# EAGLE schematic M885E (EAGLE 6.6.0)
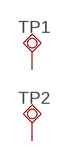
[diagram p0: schematic, sheet 1, part 1 of 2]
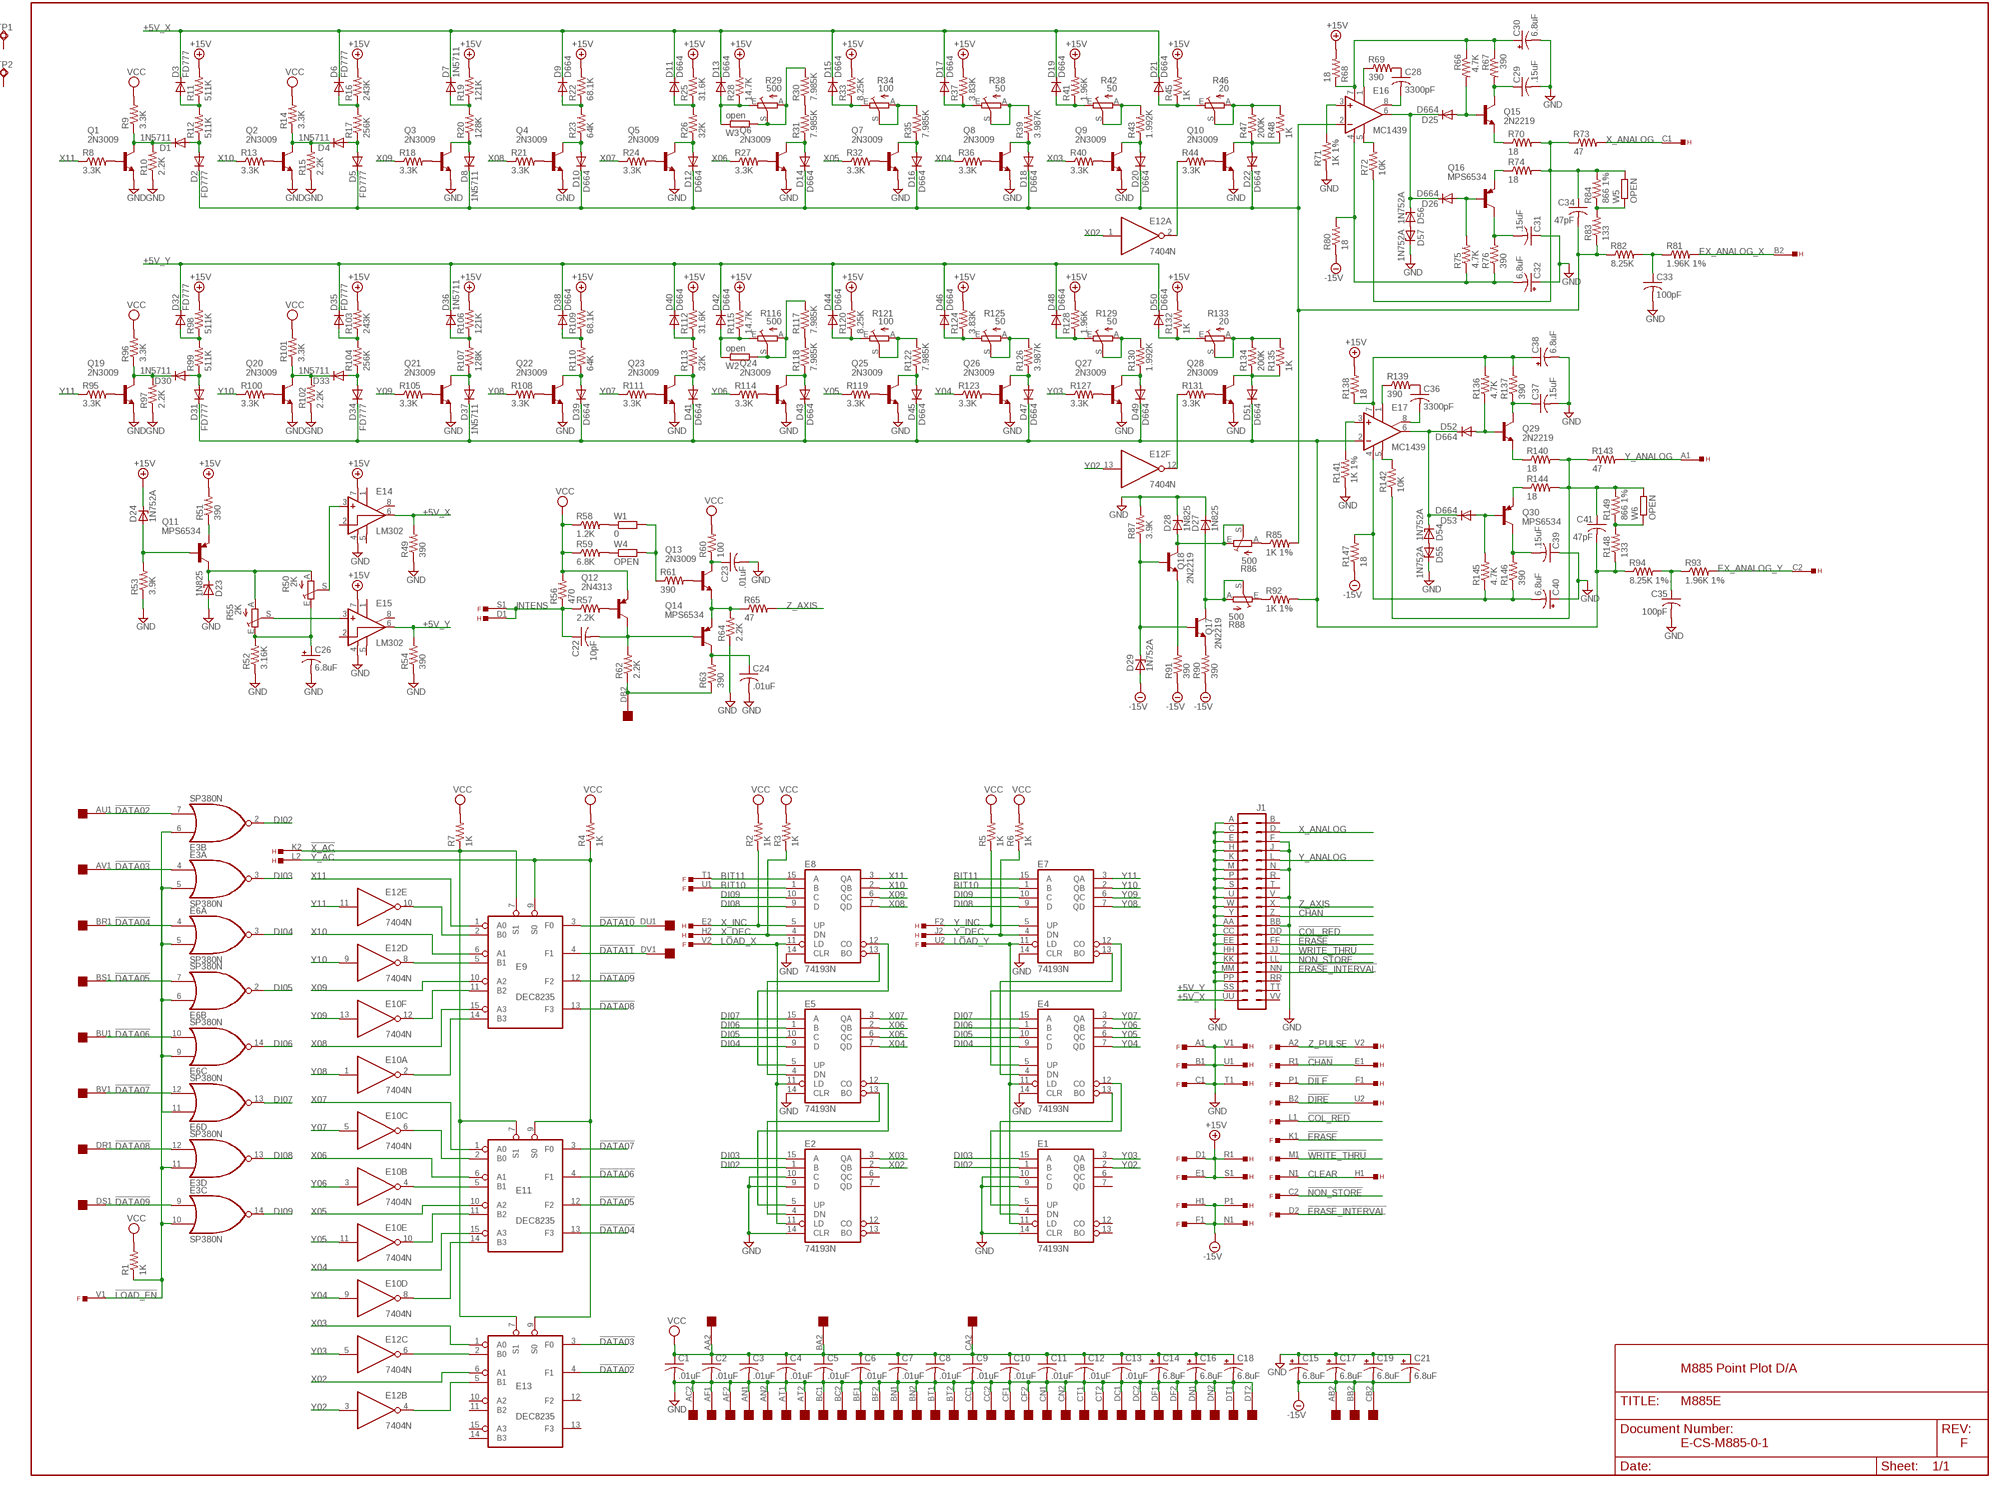
[diagram p1: schematic, sheet 1, part 2 of 2]

## Parts
C1  .01uF  C-US  [C063-025X075]
C2  .01uF  C-US  [C063-025X075]
C3  .01uF  C-US  [C063-025X075]
C4  .01uF  C-US  [C063-025X075]
C5  .01uF  C-US  [C063-025X075]
C6  .01uF  C-US  [C063-025X075]
C7  .01uF  C-US  [C063-025X075]
C8  .01uF  C-US  [C063-025X075]
C9  .01uF  C-US  [C063-025X075]
C10  .01uF  C-US  [C063-025X075]
C11  .01uF  C-US  [C063-025X075]
C12  .01uF  C-US  [C063-025X075]
C13  .01uF  C-US  [C063-025X075]
C14  6.8uF  CPOL-USE20-8AXIAL  [E12-8]
C15  6.8uF  CPOL-USE20-8AXIAL  [E12-8]
C16  6.8uF  CPOL-USE20-8AXIAL  [E12-8]
C17  6.8uF  CPOL-USE20-8AXIAL  [E12-8]
C18  6.8uF  CPOL-USE20-8AXIAL  [E12-8]
C19  6.8uF  CPOL-USE20-8AXIAL  [E12-8]
C21  6.8uF  CPOL-USE20-8AXIAL  [E12-8]
C22  10pF  C-US  [C063-025X075]
C23  .01uF  C-US  [C063-025X075]
C24  .01uF  C-US  [C063-025X075]
C26  6.8uF  CPOL-USE20-8AXIAL  [E12-8]
C28  3300pF  C-US150-054X183  [C150-054X183]
C29  .15uF  C-US150-054X183  [C150-054X183]
C30  6.8uF  CPOL-USE20-8AXIAL  [E12-8]
C31  .15uF  C-US150-054X183  [C150-054X183]
C32  6.8uF  CPOL-USE20-8AXIAL  [E12-8]
C33  100pF  C-US  [C063-025X075]
C34  47pF  C-US  [C063-025X075]
C35  100pF  C-US  [C063-025X075]
C36  3300pF  C-US150-054X183  [C150-054X183]
C37  .15uF  C-US150-054X183  [C150-054X183]
C38  6.8uF  CPOL-USE20-8AXIAL  [E12-8]
C39  .15uF  C-US150-054X183  [C150-054X183]
C40  6.8uF  CPOL-USE20-8AXIAL  [E12-8]
C41  47pF  C-US  [C063-025X075]
D1  1N5711  DIODE-DO35-10  [DO35-10]
D2  FD777  DIODE-DO35-10  [DO35-10]
D3  FD777  DIODE-DO35-10  [DO35-10]
D4  1N5711  DIODE-DO35-10  [DO35-10]
D5  FD777  DIODE-DO35-10  [DO35-10]
D6  FD777  DIODE-DO35-10  [DO35-10]
D7  1N5711  DIODE-DO35-10  [DO35-10]
D8  1N5711  DIODE-DO35-10  [DO35-10]
D9  D664  DIODE-DO35-10  [DO35-10]
D10  D664  DIODE-DO35-10  [DO35-10]
D11  D664  DIODE-DO35-10  [DO35-10]
D12  D664  DIODE-DO35-10  [DO35-10]
D13  D664  DIODE-DO35-10  [DO35-10]
D14  D664  DIODE-DO35-10  [DO35-10]
D15  D664  DIODE-DO35-10  [DO35-10]
D16  D664  DIODE-DO35-10  [DO35-10]
D17  D664  DIODE-DO35-10  [DO35-10]
D18  D664  DIODE-DO35-10  [DO35-10]
D19  D664  DIODE-DO35-10  [DO35-10]
D20  D664  DIODE-DO35-10  [DO35-10]
D21  D664  DIODE-DO35-10  [DO35-10]
D22  D664  DIODE-DO35-10  [DO35-10]
D23  1N825  ZENER-DIODEDO35Z10  [DO35Z10]
D24  1N752A  ZENER-DIODEDO35Z10  [DO35Z10]
D25  D664  DIODE-DO35-10  [DO35-10]
D26  D664  DIODE-DO35-10  [DO35-10]
D27  1N825  ZENER-DIODEDO35Z10  [DO35Z10]
D28  1N825  ZENER-DIODEDO35Z10  [DO35Z10]
D29  1N752A  ZENER-DIODEDO35Z10  [DO35Z10]
D30  1N5711  DIODE-DO35-10  [DO35-10]
D31  FD777  DIODE-DO35-10  [DO35-10]
D32  FD777  DIODE-DO35-10  [DO35-10]
D33  1N5711  DIODE-DO35-10  [DO35-10]
D34  FD777  DIODE-DO35-10  [DO35-10]
D35  FD777  DIODE-DO35-10  [DO35-10]
D36  1N5711  DIODE-DO35-10  [DO35-10]
D37  1N5711  DIODE-DO35-10  [DO35-10]
D38  D664  DIODE-DO35-10  [DO35-10]
D39  D664  DIODE-DO35-10  [DO35-10]
D40  D664  DIODE-DO35-10  [DO35-10]
D41  D664  DIODE-DO35-10  [DO35-10]
D42  D664  DIODE-DO35-10  [DO35-10]
D43  D664  DIODE-DO35-10  [DO35-10]
D44  D664  DIODE-DO35-10  [DO35-10]
D45  D664  DIODE-DO35-10  [DO35-10]
D46  D664  DIODE-DO35-10  [DO35-10]
D47  D664  DIODE-DO35-10  [DO35-10]
D48  D664  DIODE-DO35-10  [DO35-10]
D49  D664  DIODE-DO35-10  [DO35-10]
D50  D664  DIODE-DO35-10  [DO35-10]
D51  D664  DIODE-DO35-10  [DO35-10]
D52  D664  DIODE-DO35-10  [DO35-10]
D53  D664  DIODE-DO35-10  [DO35-10]
D54  1N752A  ZENER-DIODEDO35Z10  [DO35Z10]
D55  1N752A  ZENER-DIODEDO35Z10  [DO35Z10]
D56  1N752A  ZENER-DIODEDO35Z10  [DO35Z10]
D57  1N752A  ZENER-DIODEDO35Z10  [DO35Z10]
E1  74193N  [DIL16]
E2  74193N  [DIL16]
E3  SP380N  [DIL14]
E4  74193N  [DIL16]
E5  74193N  [DIL16]
E6  SP380N  [DIL14]
E7  74193N  [DIL16]
E8  74193N  [DIL16]
E9  DEC8235  [DIL16]
E10  7404N  [DIL14]
E11  DEC8235  [DIL16]
E12  7404N  [DIL14]
E13  DEC8235  [DIL16]
E14  LM302  AD504H  [TO99]
E15  LM302  AD504H  [TO99]
E16  MC1439  AD504H  [TO99]
E17  MC1439  AD504H  [TO99]
F  EDGE-TOP  [EDGE-CON2]
H  EDGE-TOP  [EDGE-CON2]
J1  DEC40PINH  [DEC40PINH]
OMNIBUS  QUAD  [EDGE-CON8]
Q1  2N3009  -NPN-TO5  [TO5]
Q2  2N3009  -NPN-TO5  [TO5]
Q3  2N3009  -NPN-TO5  [TO5]
Q4  2N3009  -NPN-TO5  [TO5]
Q5  2N3009  -NPN-TO5  [TO5]
Q6  2N3009  -NPN-TO5  [TO5]
Q7  2N3009  -NPN-TO5  [TO5]
Q8  2N3009  -NPN-TO5  [TO5]
Q9  2N3009  -NPN-TO5  [TO5]
Q10  2N3009  -NPN-TO5  [TO5]
Q11  MPS6534  -PNP-TO5  [TO5]
Q12  2N4313  -PNP-TO5  [TO5]
Q13  2N3009  -NPN-TO5  [TO5]
Q14  MPS6534  -PNP-TO5  [TO5]
Q15  2N2219  -NPN-TO5  [TO5]
Q16  MPS6534  -PNP-TO5  [TO5]
Q17  2N2219  -NPN-TO5  [TO5]
Q18  2N2219  -NPN-TO5  [TO5]
Q19  2N3009  -NPN-TO5  [TO5]
Q20  2N3009  -NPN-TO5  [TO5]
Q21  2N3009  -NPN-TO5  [TO5]
Q22  2N3009  -NPN-TO5  [TO5]
Q23  2N3009  -NPN-TO5  [TO5]
Q24  2N3009  -NPN-TO5  [TO5]
Q25  2N3009  -NPN-TO5  [TO5]
Q26  2N3009  -NPN-TO5  [TO5]
Q27  2N3009  -NPN-TO5  [TO5]
Q28  2N3009  -NPN-TO5  [TO5]
Q29  2N2219  -NPN-TO5  [TO5]
Q30  MPS6534  -PNP-TO5  [TO5]
R1  1K  R-US_0207/10  [0207/10]
R2  1K  R-US_0207/10  [0207/10]
R3  1K  R-US_0207/10  [0207/10]
R4  1K  R-US_0207/10  [0207/10]
R5  1K  R-US_0207/10  [0207/10]
R6  1K  R-US_0207/10  [0207/10]
R7  1K  R-US_0207/10  [0207/10]
R8  3.3K  R-US_0207/10  [0207/10]
R9  3.3K  R-US_0207/10  [0207/10]
R10  2.2K  R-US_0207/10  [0207/10]
R11  511K  R-US_0207/15  [0207/15]
R12  511K  R-US_0207/15  [0207/15]
R13  3.3K  R-US_0207/10  [0207/10]
R14  3.3K  R-US_0207/10  [0207/10]
R15  2.2K  R-US_0207/10  [0207/10]
R16  243K  R-US_0207/15  [0207/15]
R17  256K  R-US_0207/15  [0207/15]
R18  3.3K  R-US_0207/10  [0207/10]
R19  121K  R-US_0207/15  [0207/15]
R20  128K  R-US_0207/15  [0207/15]
R21  3.3K  R-US_0207/10  [0207/10]
R22  68.1K  R-US_0207/15  [0207/15]
R23  64K  R-US_0207/15  [0207/15]
R24  3.3K  R-US_0207/10  [0207/10]
R25  31.6K  R-US_0207/15  [0207/15]
R26  32K  R-US_0207/15  [0207/15]
R27  3.3K  R-US_0207/10  [0207/10]
R28  14.7K  R-US_0207/15  [0207/15]
R29  500  TRIM_EU-S75P  [S75P]
R30  7.985K  R-US_0207/15  [0207/15]
R31  7.985K  R-US_0207/15  [0207/15]
R32  3.3K  R-US_0207/10  [0207/10]
R33  8.25K  R-US_0207/15  [0207/15]
R34  100  TRIM_EU-S75P  [S75P]
R35  7.985K  R-US_0207/15  [0207/15]
R36  3.3K  R-US_0207/10  [0207/10]
R37  3.83K  R-US_0207/15  [0207/15]
R38  50  TRIM_EU-S75P  [S75P]
R39  3.987K  R-US_0207/15  [0207/15]
R40  3.3K  R-US_0207/10  [0207/10]
R41  1.96K  R-US_0207/15  [0207/15]
R42  50  TRIM_EU-S75P  [S75P]
R43  1.992K  R-US_0207/15  [0207/15]
R44  3.3K  R-US_0207/10  [0207/10]
R45  1K  R-US_0207/15  [0207/15]
R46  20  TRIM_EU-S75P  [S75P]
R47  200K  R-US_0207/15  [0207/15]
R48  1K  R-US_0207/15  [0207/15]
R49  390  R-US_0207/10  [0207/10]
R50  2K  TRIM_EU-B90P  [SP19L]
R51  390  R-US_0207/10  [0207/10]
R52  3.16K  R-US_0207/15  [0207/15]
R53  3.9K  R-US_0207/10  [0207/10]
R54  390  R-US_0207/10  [0207/10]
R55  2K  TRIM_EU-B90P  [SP19L]
R56  470  R-US_0207/10  [0207/10]
R57  2.2K  R-US_0207/10  [0207/10]
R58  1.2K  R-US_0207/10  [0207/10]
R59  6.8K  R-US_0207/10  [0207/10]
R60  100  R-US_0207/10  [0207/10]
R61  390  R-US_0207/10  [0207/10]
R62  2.2K  R-US_0207/10  [0207/10]
R63  390  R-US_0207/10  [0207/10]
R64  2.2K  R-US_0207/10  [0207/10]
R65  47  R-US_0207/10  [0207/10]
R66  4.7K  R-US_0207/10  [0207/10]
R67  390  R-US_0207/10  [0207/10]
R68  18  R-US_0207/10  [0207/10]
R69  390  R-US_0207/10  [0207/10]
R70  18  R-US_0207/10  [0207/10]
R71  1K 1%  R-US_0207/15  [0207/15]
R72  10K  R-US_0207/10  [0207/10]
R73  47  R-US_0207/10  [0207/10]
R74  18  R-US_0207/10  [0207/10]
R75  4.7K  R-US_0207/10  [0207/10]
R76  390  R-US_0207/10  [0207/10]
R80  18  R-US_0207/10  [0207/10]
R81  1.96K 1%  R-US_0207/15  [0207/15]
R82  8.25K  R-US_0207/15  [0207/15]
R83  133  R-US_0207/15  [0207/15]
R84  866 1%  R-US_0207/15  [0207/15]
R85  1K 1%  R-US_0207/15  [0207/15]
R86  500  TRIM_EU-B90P  [SP19L]
R87  3.9K  R-US_0207/10  [0207/10]
R88  500  TRIM_EU-B90P  [SP19L]
R90  390  R-US_0207/10  [0207/10]
R91  390  R-US_0207/10  [0207/10]
R92  1K 1%  R-US_0207/15  [0207/15]
R93  1.96K 1%  R-US_0207/15  [0207/15]
R94  8.25K 1%  R-US_0207/10  [0207/10]
R95  3.3K  R-US_0207/10  [0207/10]
R96  3.3K  R-US_0207/10  [0207/10]
R97  2.2K  R-US_0207/10  [0207/10]
R98  511K  R-US_0207/15  [0207/15]
R99  511K  R-US_0207/15  [0207/15]
R100  3.3K  R-US_0207/10  [0207/10]
R101  3.3K  R-US_0207/10  [0207/10]
R102  2.2K  R-US_0207/10  [0207/10]
R103  243K  R-US_0207/15  [0207/15]
R104  256K  R-US_0207/15  [0207/15]
R105  3.3K  R-US_0207/10  [0207/10]
R106  121K  R-US_0207/15  [0207/15]
R107  128K  R-US_0207/15  [0207/15]
R108  3.3K  R-US_0207/10  [0207/10]
R109  68.1K  R-US_0207/15  [0207/15]
R110  64K  R-US_0207/15  [0207/15]
R111  3.3K  R-US_0207/10  [0207/10]
R112  31.6K  R-US_0207/15  [0207/15]
R113  32K  R-US_0207/15  [0207/15]
R114  3.3K  R-US_0207/10  [0207/10]
R115  14.7K  R-US_0207/15  [0207/15]
R116  500  TRIM_EU-S75P  [S75P]
R117  7.985K  R-US_0207/15  [0207/15]
R118  7.985K  R-US_0207/15  [0207/15]
R119  3.3K  R-US_0207/10  [0207/10]
R120  8.25K  R-US_0207/15  [0207/15]
R121  100  TRIM_EU-S75P  [S75P]
R122  7.985K  R-US_0207/15  [0207/15]
R123  3.3K  R-US_0207/10  [0207/10]
R124  3.83K  R-US_0207/15  [0207/15]
R125  50  TRIM_EU-S75P  [S75P]
R126  3.987K  R-US_0207/15  [0207/15]
R127  3.3K  R-US_0207/10  [0207/10]
R128  1.96K  R-US_0207/15  [0207/15]
R129  50  TRIM_EU-S75P  [S75P]
R130  1.992K  R-US_0207/15  [0207/15]
R131  3.3K  R-US_0207/10  [0207/10]
R132  1K  R-US_0207/15  [0207/15]
R133  20  TRIM_EU-S75P  [S75P]
R134  200K  R-US_0207/15  [0207/15]
R135  1K  R-US_0207/15  [0207/15]
R136  4.7K  R-US_0207/10  [0207/10]
R137  390  R-US_0207/10  [0207/10]
R138  18  R-US_0207/10  [0207/10]
R139  390  R-US_0207/10  [0207/10]
R140  18  R-US_0207/10  [0207/10]
R141  1K 1%  R-US_0207/15  [0207/15]
R142  10K  R-US_0207/10  [0207/10]
R143  47  R-US_0207/10  [0207/10]
R144  18  R-US_0207/10  [0207/10]
R145  4.7K  R-US_0207/10  [0207/10]
R146  390  R-US_0207/10  [0207/10]
R147  18  R-US_0207/10  [0207/10]
R148  133  R-US_0207/15  [0207/15]
R149  866 1%  R-US_0207/15  [0207/15]
TP1  TPSQPAD1-17  [P1-17]
TP2  TPSQPAD1-17  [P1-17]
W1  0  R-EU_0207/10  [0207/10]
W2  open  R-EU_0207/10  [0207/10]
W3  open  R-EU_0207/10  [0207/10]
W4  OPEN  R-EU_0207/10  [0207/10]
W5  OPEN  R-EU_0207/10  [0207/10]
W6  OPEN  R-EU_0207/10  [0207/10]

## Nets
!CHAN: F.R1 H.E1 J1.Z
!COL_RED: F.L1 J1.DD
!DATA02: E3.7(B:I1) E13.4(F1) OMNIBUS.AU1
!DATA03: E3.4(A:I0) E13.3(F0) OMNIBUS.AV1
!DATA04: E6.4(A:I0) E11.13(F3) OMNIBUS.BR1
!DATA05: E6.7(B:I1) E11.12(F2) OMNIBUS.BS1
!DATA06: E6.10(C:I1) E11.4(F1) OMNIBUS.BU1
!DATA07: E6.12(D:I1) E11.3(F0) OMNIBUS.BV1
!DATA08: E3.12(D:I1) E9.13(F3) OMNIBUS.DR1
!DATA09: E3.9(C:I0) E9.12(F2) OMNIBUS.DS1
!DATA10: E9.3(F0) OMNIBUS.DU1
!DATA11: E9.4(F1) OMNIBUS.DV1
!DILE: F.P1 H.F1
!DIRE: F.B2 H.U2
!ERASE: F.K1 J1.FF
!ERASE_INTERVAL: F.D2 J1.NN
!LOAD_EN: E3.5(A:I1) E3.6(B:I0) E3.10(C:I1) E3.11(D:I0) E6.5(A:I1) E6.6(B:I0) E6.9(C:I0) E6.11(D:I0) F.V1 R1.1
!NON_STORE: F.C2 J1.LL
!WRITE_THRU: F.M1 J1.JJ
!X_AC: E9.7(S1) E11.7(S1) E13.7(S1) H.K2 R7.1
!Y_AC: E9.9(S0) E11.9(S0) E13.9(S0) H.L2 R4.1
+5V_X [supply]: D3.C D6.C D7.C D9.C D11.C D13.C D15.C D17.C D19.C D21.C E14.6(OUT) J1.UU R49.2
+5V_Y [supply]: D32.C D35.C D36.C D38.C D40.C D42.C D44.C D46.C D48.C D50.C E15.6(OUT) J1.SS R54.2
+15V [supply]: D24.C E14.7(V+) E15.7(V+) F.D1 F.E1 H.R1 H.S1 R11.2 R16.2 R19.2 R22.2 R25.2 R28.2 R33.2 R37.2 R41.2 R45.2 R51.2 R68.2 R98.2 R103.2 R106.2 R109.2 R112.2 R115.2 R120.2 R124.2 R128.2 R132.2 R138.2
-15V [supply]: C15.- C17.- C19.- C21.- D29.A F.F1 F.H1 H.N1 H.P1 OMNIBUS.AB2 OMNIBUS.BB2 OMNIBUS.CB2 R80.1 R90.1 R91.1 R147.1
BIT10: E7.1(B) E8.1(B) F.U1
BIT11: E7.15(A) E8.15(A) F.T1
CLEAR: F.N1 H.H1
DI02: E1.1(B) E2.1(B) E3.2(B:O)
DI03: E1.15(A) E2.15(A) E3.3(A:O)
DI04: E4.9(D) E5.9(D) E6.3(A:O)
DI05: E4.10(C) E5.10(C) E6.2(B:O)
DI06: E4.1(B) E5.1(B) E6.14(C:O)
DI07: E4.15(A) E5.15(A) E6.13(D:O)
DI08: E3.13(D:O) E7.9(D) E8.9(D)
DI09: E3.14(C:O) E7.10(C) E8.10(C)
EX_ANALOG_X: H.B2 R81.2
EX_ANALOG_Y: H.C2 R93.2
GND [supply]: C1.2 C2.2 C3.2 C4.2 C5.2 C6.2 C7.2 C8.2 C9.2 C10.2 C11.2 C12.2 C13.2 C14.- C15.+ C16.- C17.+ C18.- C19.+ C21.+ C23.2 C24.2 C26.- C29.2 C30.- C31.1 C32.+ C33.2 C35.2 C37.2 C38.- C39.1 C40.+ D23.A D27.C D28.C D55.C D57.C E1.9(D) E1.10(C) E1.14(CLR) E2.9(D) E2.10(C) E2.14(CLR) E4.14(CLR) E5.14(CLR) E7.14(CLR) E8.14(CLR) E14.4(V-) E15.4(V-) F.A1 F.B1 F.C1 H.T1 H.U1 H.V1 J1.A J1.AA J1.BB J1.C J1.CC J1.E J1.EE J1.F J1.H J1.HH J1.J J1.K J1.KK J1.M J1.MM J1.N J1.P J1.PP J1.S J1.U J1.V J1.W J1.Y OMNIBUS.AC2 OMNIBUS.AF1 OMNIBUS.AF2 OMNIBUS.AN1 OMNIBUS.AN2 OMNIBUS.AT1 OMNIBUS.AT2 OMNIBUS.BC1 OMNIBUS.BC2 OMNIBUS.BF1 OMNIBUS.BF2 OMNIBUS.BN1 OMNIBUS.BN2 OMNIBUS.BT1 OMNIBUS.BT2 OMNIBUS.CC1 OMNIBUS.CC2 OMNIBUS.CF1 OMNIBUS.CF2 OMNIBUS.CN1 OMNIBUS.CN2 OMNIBUS.CT1 OMNIBUS.CT2 OMNIBUS.DC1 OMNIBUS.DC2 OMNIBUS.DF1 OMNIBUS.DF2 OMNIBUS.DN1 OMNIBUS.DN2 OMNIBUS.DT1 OMNIBUS.DT2 Q1.1(E) Q2.1(E) Q3.1(E) Q4.1(E) Q5.1(E) Q6.1(E) Q7.1(E) Q8.1(E) Q9.1(E) Q10.1(E) Q19.1(E) Q20.1(E) Q21.1(E) Q22.1(E) Q23.1(E) Q24.1(E) Q25.1(E) Q26.1(E) Q27.1(E) Q28.1(E) R10.1 R15.1 R49.1 R52.1 R53.1 R54.1 R64.1 R71.1 R87.2 R97.1 R102.1 R141.1
INTENS: C22.1 F.S1 H.D1 R56.1 R57.1
LOAD_X: E2.11(LD) E5.11(LD) E8.11(LD) F.V2
LOAD_Y: E1.11(LD) E4.11(LD) E7.11(LD) F.U2
N$1: E9.2(B0) E12.10(E:O)
N$2: E9.5(B1) E12.8(D:O)
N$3: E9.11(B2) E10.12(F:O)
N$4: E9.14(B3) E10.2(A:O)
N$5: E10.6(C:O) E11.2(B0)
N$6: E1.4(DN) E4.13(BO)
N$7: E10.4(B:O) E11.5(B1)
N$8: E10.10(E:O) E11.11(B2)
N$9: E10.8(D:O) E11.14(B3)
N$10: E1.5(UP) E4.12(CO)
N$11: E12.6(C:O) E13.2(B0)
N$12: E4.4(DN) E7.13(BO)
N$13: E12.4(B:O) E13.5(B1)
N$14: E4.5(UP) E7.12(CO)
N$15: D3.A R11.1 R12.2
N$16: D1.A D2.A R12.1
N$17: D7.A R19.1 R20.2
N$18: D13.A R28.1 R29.E W3.1
N$19: Q1.2(B) R8.2
N$20: D1.C Q1.3(C) R9.1 R10.2
N$21: E2.4(DN) E5.13(BO)
N$22: E2.5(UP) E5.12(CO)
N$23: E5.4(DN) E8.13(BO)
N$24: E5.5(UP) E8.12(CO)
N$25: D6.A R16.1 R17.2
N$26: D4.A D5.A R17.1
N$27: C34.2 D2.C D5.C D8.C D10.C D12.C D14.C D16.C D18.C D20.C D22.C E16.2(-IN) R82.1 R83.1 R85.2
N$28: Q2.2(B) R13.2
N$29: D4.C Q2.3(C) R14.1 R15.2
N$30: R30.1 R31.2
N$31: D8.A Q3.3(C) R20.1
N$32: Q3.2(B) R18.2
N$33: D32.A R98.1 R99.2
N$34: R29.A R29.S R30.2 W3.2
N$35: R34.A R34.S R35.2
N$36: D9.A R22.1 R23.2
N$37: D10.A Q4.3(C) R23.1
N$38: Q4.2(B) R21.2
N$39: D30.A D31.A R99.1
N$40: D17.A R37.1 R38.E
N$41: R42.A R42.S R43.2
N$42: D11.A R25.1 R26.2
N$43: D12.A Q5.3(C) R26.1
N$44: Q5.2(B) R24.2
N$45: Q19.2(B) R95.2
N$46: R46.A R46.S R47.2 R48.2
N$47: D30.C Q19.3(C) R96.1 R97.2
N$48: D35.A R103.1 R104.2
N$49: D14.A Q6.3(C) R31.1
N$50: Q6.2(B) R27.2
N$51: D33.A D34.A R104.1
N$52: C41.2 D31.C D34.C D37.C D39.C D41.C D43.C D45.C D47.C D49.C D51.C E17.2(-IN) R92.2 R94.1 R148.1
N$53: Q20.2(B) R100.2
N$54: D15.A R33.1 R34.E
N$55: D16.A Q7.3(C) R35.1
N$56: Q7.2(B) R32.2
N$57: D33.C Q20.3(C) R101.1 R102.2
N$58: D36.A R106.1 R107.2
N$59: D37.A Q21.3(C) R107.1
N$60: R38.A R38.S R39.2
N$61: D18.A Q8.3(C) R39.1
N$62: Q8.2(B) R36.2
N$63: Q21.2(B) R105.2
N$64: D38.A R109.1 R110.2
N$65: D39.A Q22.3(C) R110.1
N$66: D19.A R41.1 R42.E
N$67: D20.A Q9.3(C) R43.1
N$68: Q9.2(B) R40.2
N$69: Q22.2(B) R108.2
N$70: D40.A R112.1 R113.2
N$71: D41.A Q23.3(C) R113.1
N$72: D21.A R45.1 R46.E
N$73: D22.A Q10.3(C) R47.1 R48.1
N$74: Q10.2(B) R44.2
N$75: Q23.2(B) R111.2
N$76: E12.2(A:O) R44.1
N$77: D43.A Q24.3(C) R118.1
N$78: Q24.2(B) R114.2
N$79: D44.A R120.1 R121.E
N$80: D45.A Q25.3(C) R122.1
N$81: Q25.2(B) R119.2
N$82: R125.A R125.S R126.2
N$83: D47.A Q26.3(C) R126.1
N$84: Q26.2(B) R123.2
N$85: D48.A R128.1 R129.E
N$86: D49.A Q27.3(C) R130.1
N$87: Q27.2(B) R127.2
N$88: D50.A R132.1 R133.E
N$89: D51.A Q28.3(C) R134.1 R135.1
N$90: Q28.2(B) R131.2
N$91: E12.12(F:O) R131.1
N$92: D42.A R115.1 R116.E W2.1
N$93: R117.1 R118.2
N$94: R116.A R116.S R117.2 W2.2
N$95: R121.A R121.S R122.2
N$96: D46.A R124.1 R125.E
N$97: R129.A R129.S R130.2
N$98: R133.A R133.S R134.2 R135.2
N$99: D24.A Q11.2(B) R53.2
N$100: Q11.1(E) R51.1
N$101: D23.C Q11.3(C) R50.A R55.A
N$102 [supply]: C26.+ R50.E R52.2 R55.E
N$103: E15.3(+IN) R55.S
N$104: Q12.2(B) R57.2
N$105: E14.3(+IN) R50.S
N$106: C22.2 Q12.3(C) Q14.2(B) R62.2
N$107 [supply]: OMNIBUS.DB2 R62.1 R63.1
N$108: C24.1 Q14.3(C) R63.2
N$109: Q13.1(E) Q14.1(E) R64.2 R65.1
N$110: R58.2 W1.1
N$111: R59.2 W4.1
N$112: Q13.2(B) R61.2
N$113: R61.1 W1.2 W4.2
N$114: C30.+ E16.7(V+) R66.1 R67.1 R68.1
N$115: C23.1 Q13.3(C) R60.1
N$116: E16.1(ON1) R69.1
N$117: C28.1 R69.2
N$118: C28.2 E16.8(ON2)
N$119: D25.A Q15.2(B) R66.2
N$120: D26.A Q16.2(B) R75.2
N$121: D25.C D26.C D56.C E16.6(OUT)
N$122: D56.A D57.A
N$123: C32.- E16.4(V-) R75.1 R76.1 R80.2
N$124: C29.1 Q15.3(C) R67.2
N$125: C31.2 Q16.3(C) R76.2
N$126: Q16.1(E) R74.1
N$127: E16.5(OPT) R72.2
N$128: C34.1 R70.2 R72.1 R73.1 R74.2 R84.2 W5.2
N$129: Q15.1(E) R70.1
N$130: C33.1 R81.1 R82.2
N$131: R83.2 R84.1 W5.1
N$132: E16.3(+IN) R71.2
N$133: R85.1 R86.A
N$134: D54.A D55.A
N$135: D29.C Q17.2(B) Q18.2(B) R87.1
N$136: Q18.1(E) R91.2
N$137: Q17.1(E) R90.2
N$138: D28.A Q18.3(C) R86.E R86.S
N$139: D27.A Q17.3(C) R88.A R88.S
N$140: R88.E R92.1
N$141: C38.+ E17.7(V+) R136.2 R137.2 R138.1
N$142: C36.1 R139.2
N$143: C36.2 E17.8(ON2)
N$144: E17.1(ON1) R139.1
N$145: D52.C D53.C D54.C E17.6(OUT)
N$147: D52.A Q29.2(B) R136.1
N$148: C37.1 Q29.3(C) R137.1
N$149: D53.A Q30.2(B) R145.2
N$150: C39.2 Q30.3(C) R146.2
N$151: C40.- E17.4(V-) R145.1 R146.1 R147.2
N$152: E17.5(OPT) R142.2
N$153: C41.1 R140.2 R142.1 R143.1 R144.2 R149.2 W6.2
N$154: Q30.1(E) R144.1
N$155: Q29.1(E) R140.1
N$156: E17.3(+IN) R141.2
N$157: R148.2 R149.1 W6.1
N$159: C35.1 R93.1 R94.2
VCC [supply]: C1.1 C2.1 C3.1 C4.1 C5.1 C6.1 C7.1 C8.1 C9.1 C10.1 C11.1 C12.1 C13.1 C14.+ C16.+ C18.+ OMNIBUS.AA2 OMNIBUS.BA2 OMNIBUS.CA2 Q12.1(E) R1.2 R2.2 R3.2 R4.2 R5.2 R6.2 R7.2 R9.2 R14.2 R56.2 R58.1 R59.1 R60.2 R96.2 R101.2
X02: E2.2(QB) E12.1(A:I) E13.6(A1)
X03: E2.3(QA) E13.1(A0) R40.1
X04: E5.7(QD) E11.15(A3) R36.1
X05: E5.6(QC) E11.10(A2) R32.1
X06: E5.2(QB) E11.6(A1) R27.1
X07: E5.3(QA) E11.1(A0) R24.1
X08: E8.7(QD) E9.15(A3) R21.1
X09: E8.6(QC) E9.10(A2) R18.1
X10: E8.2(QB) E9.6(A1) R13.1
X11: E8.3(QA) E9.1(A0) R8.1
X_ANALOG: H.C1 J1.D R73.2
X_DEC: E8.4(DN) H.H2 R3.1
X_INC: E8.5(UP) H.E2 R2.1
Y02: E1.2(QB) E12.3(B:I) E12.13(F:I)
Y03: E1.3(QA) E12.5(C:I) R127.1
Y04: E4.7(QD) E10.9(D:I) R123.1
Y05: E4.6(QC) E10.11(E:I) R119.1
Y06: E4.2(QB) E10.3(B:I) R114.1
Y07: E4.3(QA) E10.5(C:I) R111.1
Y08: E7.7(QD) E10.1(A:I) R108.1
Y09: E7.6(QC) E10.13(F:I) R105.1
Y10: E7.2(QB) E12.9(D:I) R100.1
Y11: E7.3(QA) E12.11(E:I) R95.1
Y_ANALOG: H.A1 J1.L R143.2
Y_DEC: E7.4(DN) H.J2 R6.1
Y_INC: E7.5(UP) H.F2 R5.1
Z_AXIS: J1.X R65.2
Z_PULSE: F.A2 H.V2
Unconnected: E1.6(QC) E1.7(QD) E1.12(CO) E1.13(BO) E2.6(QC) E2.7(QD) E2.12(CO) E2.13(BO) E13.10(A2) E13.11(B2) E13.12(F2) E13.13(F3) E13.14(B3) E13.15(A3) E14.1(ON1) E14.2(-IN) E14.5(OPT) E14.8(ON2) E15.1(ON1) E15.2(-IN) E15.5(OPT) E15.8(ON2) F.E2 F.F2 F.H2 F.J1 F.J2 F.K2 F.L2 F.M2 F.N2 F.P2 F.R2 F.S2 F.T2 H.A2 H.B1 H.D2 H.J1 H.K1 H.L1 H.M1 H.M2 H.N2 H.P2 H.R2 H.S2 H.T2 J1.B J1.R J1.RR J1.T J1.TT J1.VV OMNIBUS.AA1 OMNIBUS.AB1 OMNIBUS.AC1 OMNIBUS.AD1 OMNIBUS.AD2 OMNIBUS.AE1 OMNIBUS.AE2 OMNIBUS.AH1 OMNIBUS.AH2 OMNIBUS.AJ1 OMNIBUS.AJ2 OMNIBUS.AK1 OMNIBUS.AK2 OMNIBUS.AL1 OMNIBUS.AL2 OMNIBUS.AM1 OMNIBUS.AM2 OMNIBUS.AP1 OMNIBUS.AP2 OMNIBUS.AR1 OMNIBUS.AR2 OMNIBUS.AS1 OMNIBUS.AS2 OMNIBUS.AU2 OMNIBUS.AV2 OMNIBUS.BA1 OMNIBUS.BB1 OMNIBUS.BD1 OMNIBUS.BD2 OMNIBUS.BE1 OMNIBUS.BE2 OMNIBUS.BH1 OMNIBUS.BH2 OMNIBUS.BJ1 OMNIBUS.BJ2 OMNIBUS.BK1 OMNIBUS.BK2 OMNIBUS.BL1 OMNIBUS.BL2 OMNIBUS.BM1 OMNIBUS.BM2 OMNIBUS.BP1 OMNIBUS.BP2 OMNIBUS.BR2 OMNIBUS.BS2 OMNIBUS.BU2 OMNIBUS.BV2 OMNIBUS.CA1 OMNIBUS.CB1 OMNIBUS.CD1 OMNIBUS.CD2 OMNIBUS.CE1 OMNIBUS.CE2 OMNIBUS.CH1 OMNIBUS.CH2 OMNIBUS.CJ1 OMNIBUS.CJ2 OMNIBUS.CK1 OMNIBUS.CK2 OMNIBUS.CL1 OMNIBUS.CL2 OMNIBUS.CM1 OMNIBUS.CM2 OMNIBUS.CP1 OMNIBUS.CP2 OMNIBUS.CR1 OMNIBUS.CR2 OMNIBUS.CS1 OMNIBUS.CS2 OMNIBUS.CU1 OMNIBUS.CU2 OMNIBUS.CV1 OMNIBUS.CV2 OMNIBUS.DA1 OMNIBUS.DA2 OMNIBUS.DB1 OMNIBUS.DD1 OMNIBUS.DD2 OMNIBUS.DE1 OMNIBUS.DE2 OMNIBUS.DH1 OMNIBUS.DH2 OMNIBUS.DJ1 OMNIBUS.DJ2 OMNIBUS.DK1 OMNIBUS.DK2 OMNIBUS.DL1 OMNIBUS.DL2 OMNIBUS.DM1 OMNIBUS.DM2 OMNIBUS.DP1 OMNIBUS.DP2 OMNIBUS.DR2 OMNIBUS.DS2 OMNIBUS.DU2 OMNIBUS.DV2 TP1.TP TP2.TP

## Notes on the sheet
- M885 Point Plot D/A
- E-CS-M885-0-1 | F

## Power pins joined to a net without a drawn wire
GND: E1.8(GND) E2.8(GND) E3.1(P:GND) E4.8(GND) E5.8(GND) E6.1(P:GND) E7.8(GND) E8.8(GND) E9.8(GND) E10.7(P:GND) E11.8(GND) E12.7(P:GND) E13.8(GND)
VCC: E1.16(VCC) E2.16(VCC) E3.8(P:VCC) E4.16(VCC) E5.16(VCC) E6.8(P:VCC) E7.16(VCC) E8.16(VCC) E9.16(VCC) E10.14(P:VCC) E11.16(VCC) E12.14(P:VCC) E13.16(VCC)

## Library data of the parts
C1-C13 C22-C24 C33-C35 C41 = dec-con:C-US: Capacitors with funky DEC lead spacing.
C14-C19 C21 C26 C30 C32 C38 C40 = dec-con:CPOL-USE20-8AXIAL: A 0.8 inch electrolytic.
C28 C29 C31 C36 C37 C39 = rcl:C-US: CAPACITOR, American symbol
D1-D22 D25 D26 D30-D53 = diode:DIODE-: DIODE
D23 D24 D27-D29 D54-D57 = diode:ZENER-DIODE: Z-Diode
E1 E2 E4 E5 E7 E8 = dec-con:74*193: Synchronous 4-bit UP/DOWN COUNTER
E3 E6 = dec-con:SP380: Quad NOR gate (use 8640)
E9 E11 E13 = dec-con:DEC8235: 4-bit data selector
E10 E12 = 74xx-us:74*04: Hex INVERTER
E14-E17 = linear:AD504: OP AMP
F H = dec-con:EDGE-TOP: Labeled DEC edge connector, suitable for top connector.
J1 = dec-con:DEC40PIN: PIN HEADER
OMNIBUS = dec-con:QUAD: Quad-Height DEC board
Q1-Q10 Q13 Q15 Q17-Q29 = transistor:*-NPN-: NPN Transistror BF959 corrected 2008.03.06
Q11 Q12 Q14 Q16 Q30 = transistor:*-PNP-: PNP Transistror
R1-R28 R30-R33 R35-R37 R39-R41 R43-R45 R47-R49 R51-R54 R56-R76 R80-R85 R87 R90-R115 R117-R120 R122-R124 R126-R128 R130-R132 R134-R149 = rcl:R-US_: RESISTOR, American symbol
R29 R34 R38 R42 R46 R50 R55 R86 R88 R116 R121 R125 R129 R133 = pot:TRIM_EU-: POTENTIOMETER
TP1 TP2 = testpad:TPSQ: Test pad
W1-W6 = rcl:R-EU_: RESISTOR, European symbol

## Net classes
1 supply: width 0.813 mm